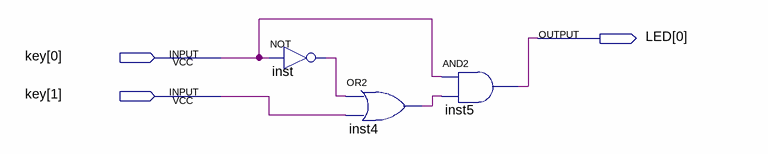
[diagram p0: schematic sheet]
// Quartus schematic ROMANOVA_01.bdf as structural Verilog: 3 symbols, 3 pins
module ROMANOVA_01 (
  input  [1:0] key,
  output [0:0] LED
);

  wire inst4_out, inst_out;

  not inst (inst_out, key[0]);
  or inst4 (inst4_out, inst_out, key[1]);
  and inst5 (LED[0], key[0], inst4_out);
endmodule
